# Altium schematic sheet 0_Architecture.SchDoc
size A4; Organization: SpaceLab UFSC; Address1: UFSC - SpaceLab; Address2: University Campus - Trindade; Address3: Dep. of Electrical Engineering - CTC; Address4: Florianópolis, Santa Catarina, Brazil; DocumentNumber: 1; Revision: 1.0; SheetNumber: 1; SheetTotal: 2; Address5: CEP: 88040 - 900
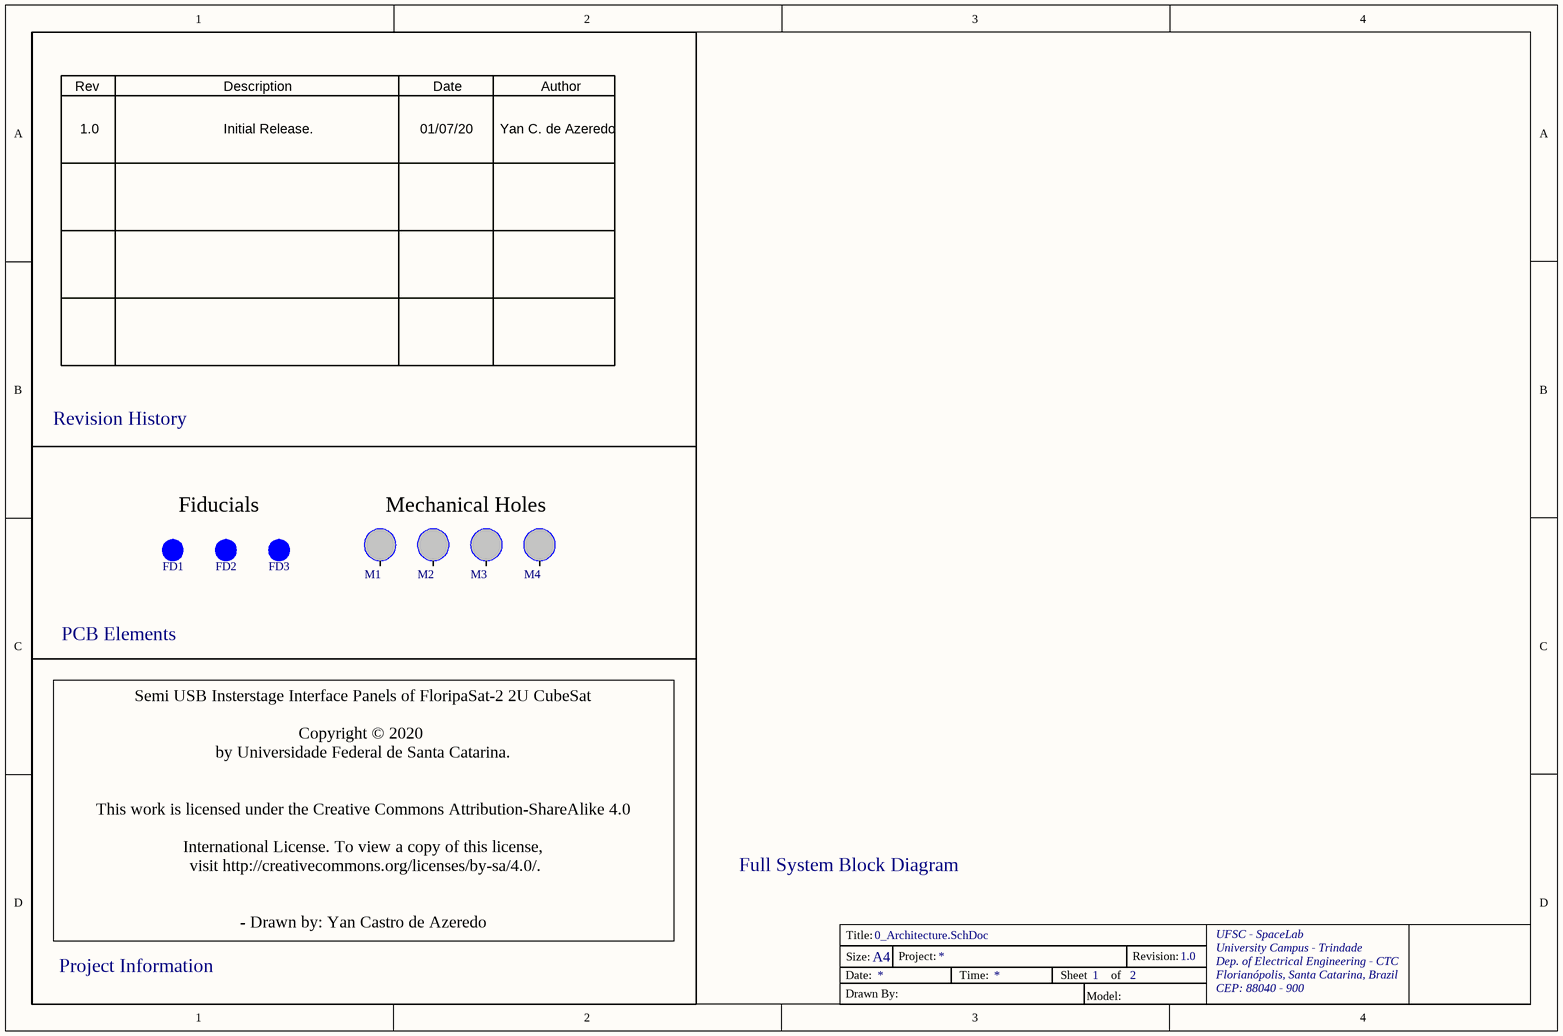
[diagram p0: 0_Architecture.SchDoc]

## Parts
FD1  Fiducial  [Fiducial 1.3mm]  (value not drawn)  (no BOM)
FD2  Fiducial  [Fiducial 1.3mm]  (value not drawn)  (no BOM)
FD3  Fiducial  [Fiducial 1.3mm]  (value not drawn)  (no BOM)
M1  IB Mechanical Hole  [IB Mechanical Hole]  (value not drawn)  (no BOM)
M2  IB Mechanical Hole  [IB Mechanical Hole]  (value not drawn)  (no BOM)
M3  IB Mechanical Hole  [IB Mechanical Hole]  (value not drawn)  (no BOM)
M4  IB Mechanical Hole  [IB Mechanical Hole]  (value not drawn)  (no BOM)

## Nets

Not connected (* = marked no-connect by the designer): M1 0; M2 0; M3 0; M4 0

## Notes on the sheet
- Rev
- Description
- Date
- Author
- 1.0
- Initial Release.
- 01/07/20
- Yan C. de Azeredo
- Revision History
- Fiducials
- Mechanical Holes
- PCB Elements
- Full System Block Diagram
- Semi USB Insterstage Interface Panels of FloripaSat-2 2U CubeSat
  Copyright © 2020
  by Universidade Federal de Santa Catarina.
  This work is licensed under the Creative Commons Attribution-ShareAlike 4.0
  International License. To view a copy of this license,
  visit http://creativecommons.org/licenses/by-sa/4.0/.
  - Drawn by: Yan Castro de Azeredo
  - Reviewers: Gabriel M. Marcelino and André M. P. Mattos
  - Support: Gabriel M. Marcelino, André M. P. Mattos and Kleber Gouveia
  - Mechanical validation: Edemar Morsch Filho
- Project Information
- Date:
- Title:
- Size:
- A4
- Project:
- Time:
- Sheet
- of
- Revision:
- UFSC - SpaceLab
- University Campus - Trindade
- Dep. of Electrical Engineering - CTC
- Florianópolis, Santa Catarina, Brazil
- CEP: 88040 - 900
- Drawn By:
- Model:

## Library data of the parts
FD1-FD3 = Fiducial: Fiducial for DB board variants
M1-M4 = IB Mechanical Hole: Mechanical Hole for FloripaSat-2 interface boards